# EAGLE design w12-reflect (EAGLE 7.5.0)
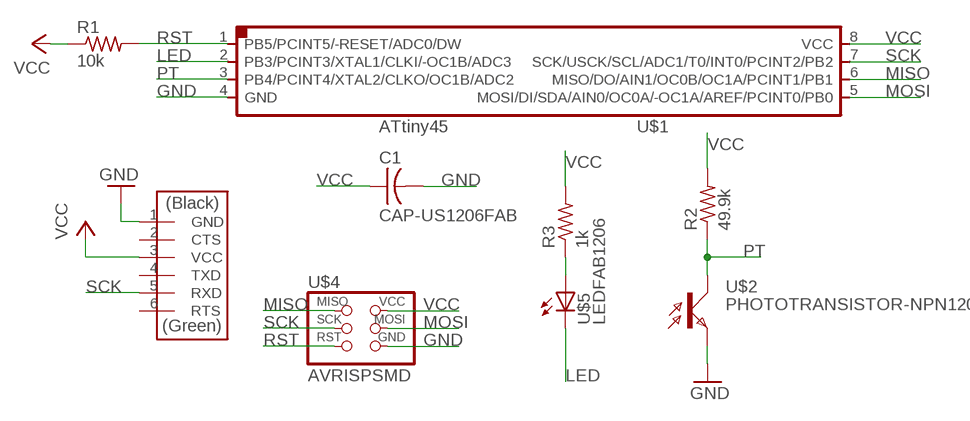
[diagram p0: schematic, sheet 1]

## Parts
C1  CAP-US1206FAB  [C1206FAB]
R1  10k  RES-US1206FAB  [R1206FAB]
R2  49.9k  RES-US1206FAB  [R1206FAB]
R3  1k  RES-US1206FAB  [R1206FAB]
U$1  ATTINY45SI  [SOIC8]
U$2  PHOTOTRANSISTOR-NPN1206  [OP1206]
U$3  FTDI-SMD-HEADER  [1X06SMD]
U$4  AVRISPSMD  [2X03SMD]
U$5  LEDFAB1206  [LED1206FAB]

## Nets
GND: C1.2 U$1.4(GND) U$2.EMITTER(E) U$3.1(GND) U$4.6(GND)
LED: U$1.2(PB3/PCINT3/XTAL1/CLKI/-OC1B/ADC3) U$5.2(C)
MISO: U$1.6(MISO/DO/AIN1/OC0B/OC1A/PCINT1/PB1) U$4.1(MISO)
MOSI: U$1.5(MOSI/DI/SDA/AIN0/OC0A/-OC1A/AREF/PCINT0/PB0) U$4.4(MOSI)
N$3: R3.1 U$5.1(A)
PT: R2.1 U$1.3(PB4/PCINT4/XTAL2/CLKO/OC1B/ADC2) U$2.COLLECTOR(C)
RST: R1.2 U$1.1(PB5/PCINT5/-RESET/ADC0/DW) U$4.5(RST)
SCK: U$1.7(SCK/USCK/SCL/ADC1/T0/INT0/PCINT2/PB2) U$3.5(RXD) U$4.3(SCK)
VCC: C1.1 R1.1 R2.2 R3.2 U$1.8(VCC) U$3.3(VCC) U$4.2(VCC)
Unconnected: U$3.2(CTS) U$3.4(TXD) U$3.6(RTS)

## Library data of the parts
C1 = fab:CAP-US
R1-R3 = fab:RES-US: Resistor (US Symbol) Variants with postfix FAB are widened to allow the routing of internal traces
U$1 = fab:ATTINY45
U$2 = fab:PHOTOTRANSISTOR-NPN
U$3 = fab:FTDI-SMD-HEADER
U$4 = fab:AVRISP
U$5 = fab:LED: LED

## Net classes
0 default: width 0.483 mm

## Board
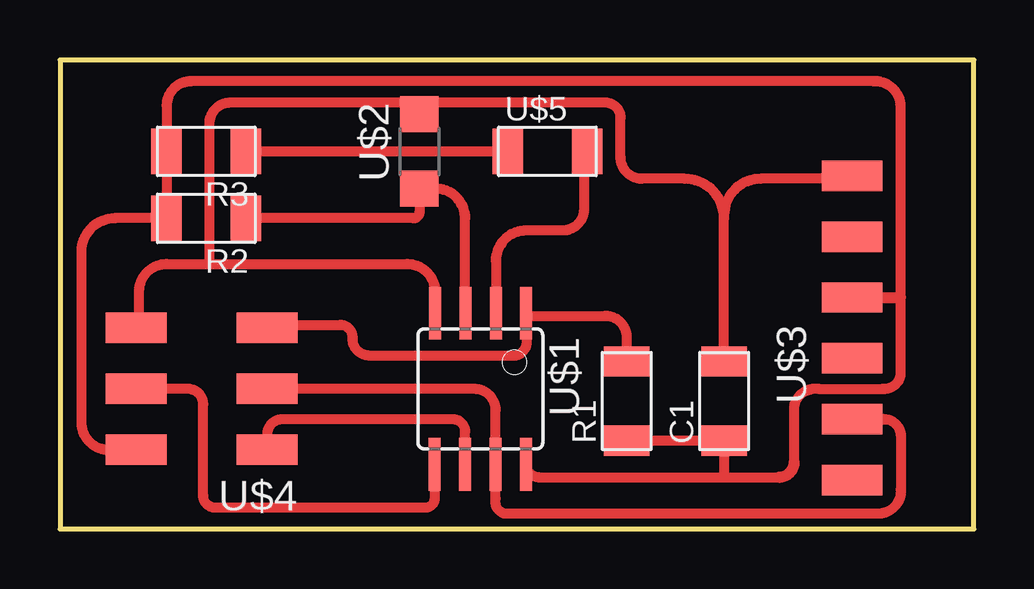
[diagram p1: board, top side]

Size 38.1 x 19.56 mm. Coordinates in mm from the lower left corner, seen from the top.
Outline: 0,0 38.1,0 38.1,19.56 0,19.56 0,0
Copper layers (1*16): Top 0.035mm / dielectric 1.5mm / Bottom 0.035mm
Design rules "fab": minimum track width 0.3mm, minimum drill 32mil, track to track 0.397mm, track to pad 0.397mm, pad to pad 0.397mm, via to via 0.397mm, smd to smd 0.315mm, copper to edge 40mil, drill to drill 16mil, minimum pad ring 10mil, minimum via ring 8mil, stop-mask expansion 4mil, vias tented up to drill 0mil, thermal gap 10mil

### Footprints (pad centres in the part's own frame; a part is rotated, then mirrored left to right if it is on the bottom)
C1206FAB = smd 1.27 x 1.905: 1 -1.651,0; 2 1.651,0
R1206FAB = smd 1.27 x 1.905: 1 -1.651,0; 2 1.651,0
SOIC8 = smd 0.5 x 2.2: 1 -1.905,-3.154; 2 -0.645,-3.154; 3 0.625,-3.154; 4 1.895,-3.154; 5 1.905,3.154; 6 0.635,3.154; 7 -0.635,3.154; 8 -1.905,3.154
OP1206 = smd 1.5 x 1.6: COLLECTOR -1.55,0; EMITTER 1.55,0
1X06SMD = smd 2.54 x 1.27: 1 0,6.35; 2 0,3.81; 3 0,1.27; 4 0,-1.27; 5 0,-3.81; 6 0,-6.35
2X03SMD = smd 2.54 x 1.27: 1 -2.54,2.54; 2 2.92,2.54; 3 -2.54,0; 4 2.92,0; 5 -2.54,-2.54; 6 2.92,-2.54
LED1206FAB = smd 1.27 x 1.905: 1 -1.651,0; 2 1.651,0

### Placement (x,y rotation side)
C1  27.69,5.33 90 top
R1  23.62,5.33 90 top
R2  6.1,12.95 180 top
R3  6.1,15.75 180 top
U$1  17.53,5.84 180 top
U$2  14.99,15.75 90 top
U$3  33.02,8.38 0 top
U$4  6.1,5.84 180 top
U$5  20.32,15.75 0 top

### Tracks (layer width: path | path; a pad name or v marks a point on that pad's centre or on a via)
GND
  Top 0.406: U$3.1 arc-90 32.89,14.61 29.21,14.61 arc90 27.69,13.08 27.69,12.95 | U$4.6 arc90 3.3,8.51 3.3,9.91 arc-90 4.45,11.05 6.22,11.05 | 6.22,11.05 14.48,11.05 arc-90 15.63,9.9 U$1.4 | U$2.EMITTER 14.99,17.53 arc90 14.73,17.78 | 14.73,17.78 7.11,17.78 arc90 6.22,16.89 6.22,11.05 | C1.2 27.69,12.95 | 27.69,12.95 arc90 26.04,14.61 24.26,14.61 arc-90 23.37,15.49 23.37,17.14 arc90 22.73,17.78 14.73,17.78
LED
  Top 0.406: U$5.2 arc90 21.84,15.62 21.84,13.34 arc-90 20.95,12.45 19.43,12.45 arc90 18.17,11.19 U$1.2
MISO
  Top 0.406: U$1.6 16.89,4.06 arc90 16.38,4.57 9.27,4.57 arc90 8.64,3.94 U$4.1
MOSI
  Top 0.406: U$1.5 15.62,1.27 arc-90 15.24,0.89 6.48,0.89 arc-90 5.97,1.4 5.97,5.21 arc90 5.33,5.84 U$4.4
N$3
  Top 0.406: R3.1 U$5.1
PT
  Top 0.406: U$1.3 arc-90 U$1.3 16.89,12.95 arc90 15.65,14.2 U$2.COLLECTOR 14.99,13.21 arc-90 14.73,12.95 R2.1
RST
  Top 0.406: U$4.5 arc-90 8.76,8.51 11.68,8.51 arc-90 12.19,8 arc90 12.83,7.24 19.05,7.24 arc90 19.43,8 U$1.1 arc90 19.54,8.89 22.73,8.89 arc-90 23.62,8 R1.2
SCK
  Top 0.406: U$4.3 17.27,5.84 arc-90 18.16,4.95 U$1.7 18.16,1.27 arc90 18.54,0.64 34.16,0.64 arc90 35.05,1.65 35.05,3.94 arc90 34.29,4.57 | U$3.5 arc-90 33.15,4.45
  Top 0.457: 33.15,4.45 arc-90 33.27,4.57 34.29,4.57
VCC
  Top 0.406: R1.1 C1.1 27.69,2.16 | U$4.2 2.03,3.3 arc-90 0.89,4.45 0.89,11.56 arc-90 2.29,12.95 R2.2 R3.2 4.45,17.65 arc-90 5.46,18.67 33.91,18.67 arc-90 35.05,17.65 35.05,9.65 35.05,6.48 arc-90 34.29,5.84 31.62,5.84 arc90 30.61,5.08 30.61,2.79 | 27.69,2.16 19.96,2.16 arc-90 U$1.8 | 27.69,2.16 29.97,2.16
  Top 0.457: 29.97,2.16 arc90 30.61,2.79 | U$3.3 35.05,9.65